# EAGLE design bridge (EAGLE 7.7.0)
REVISION: A
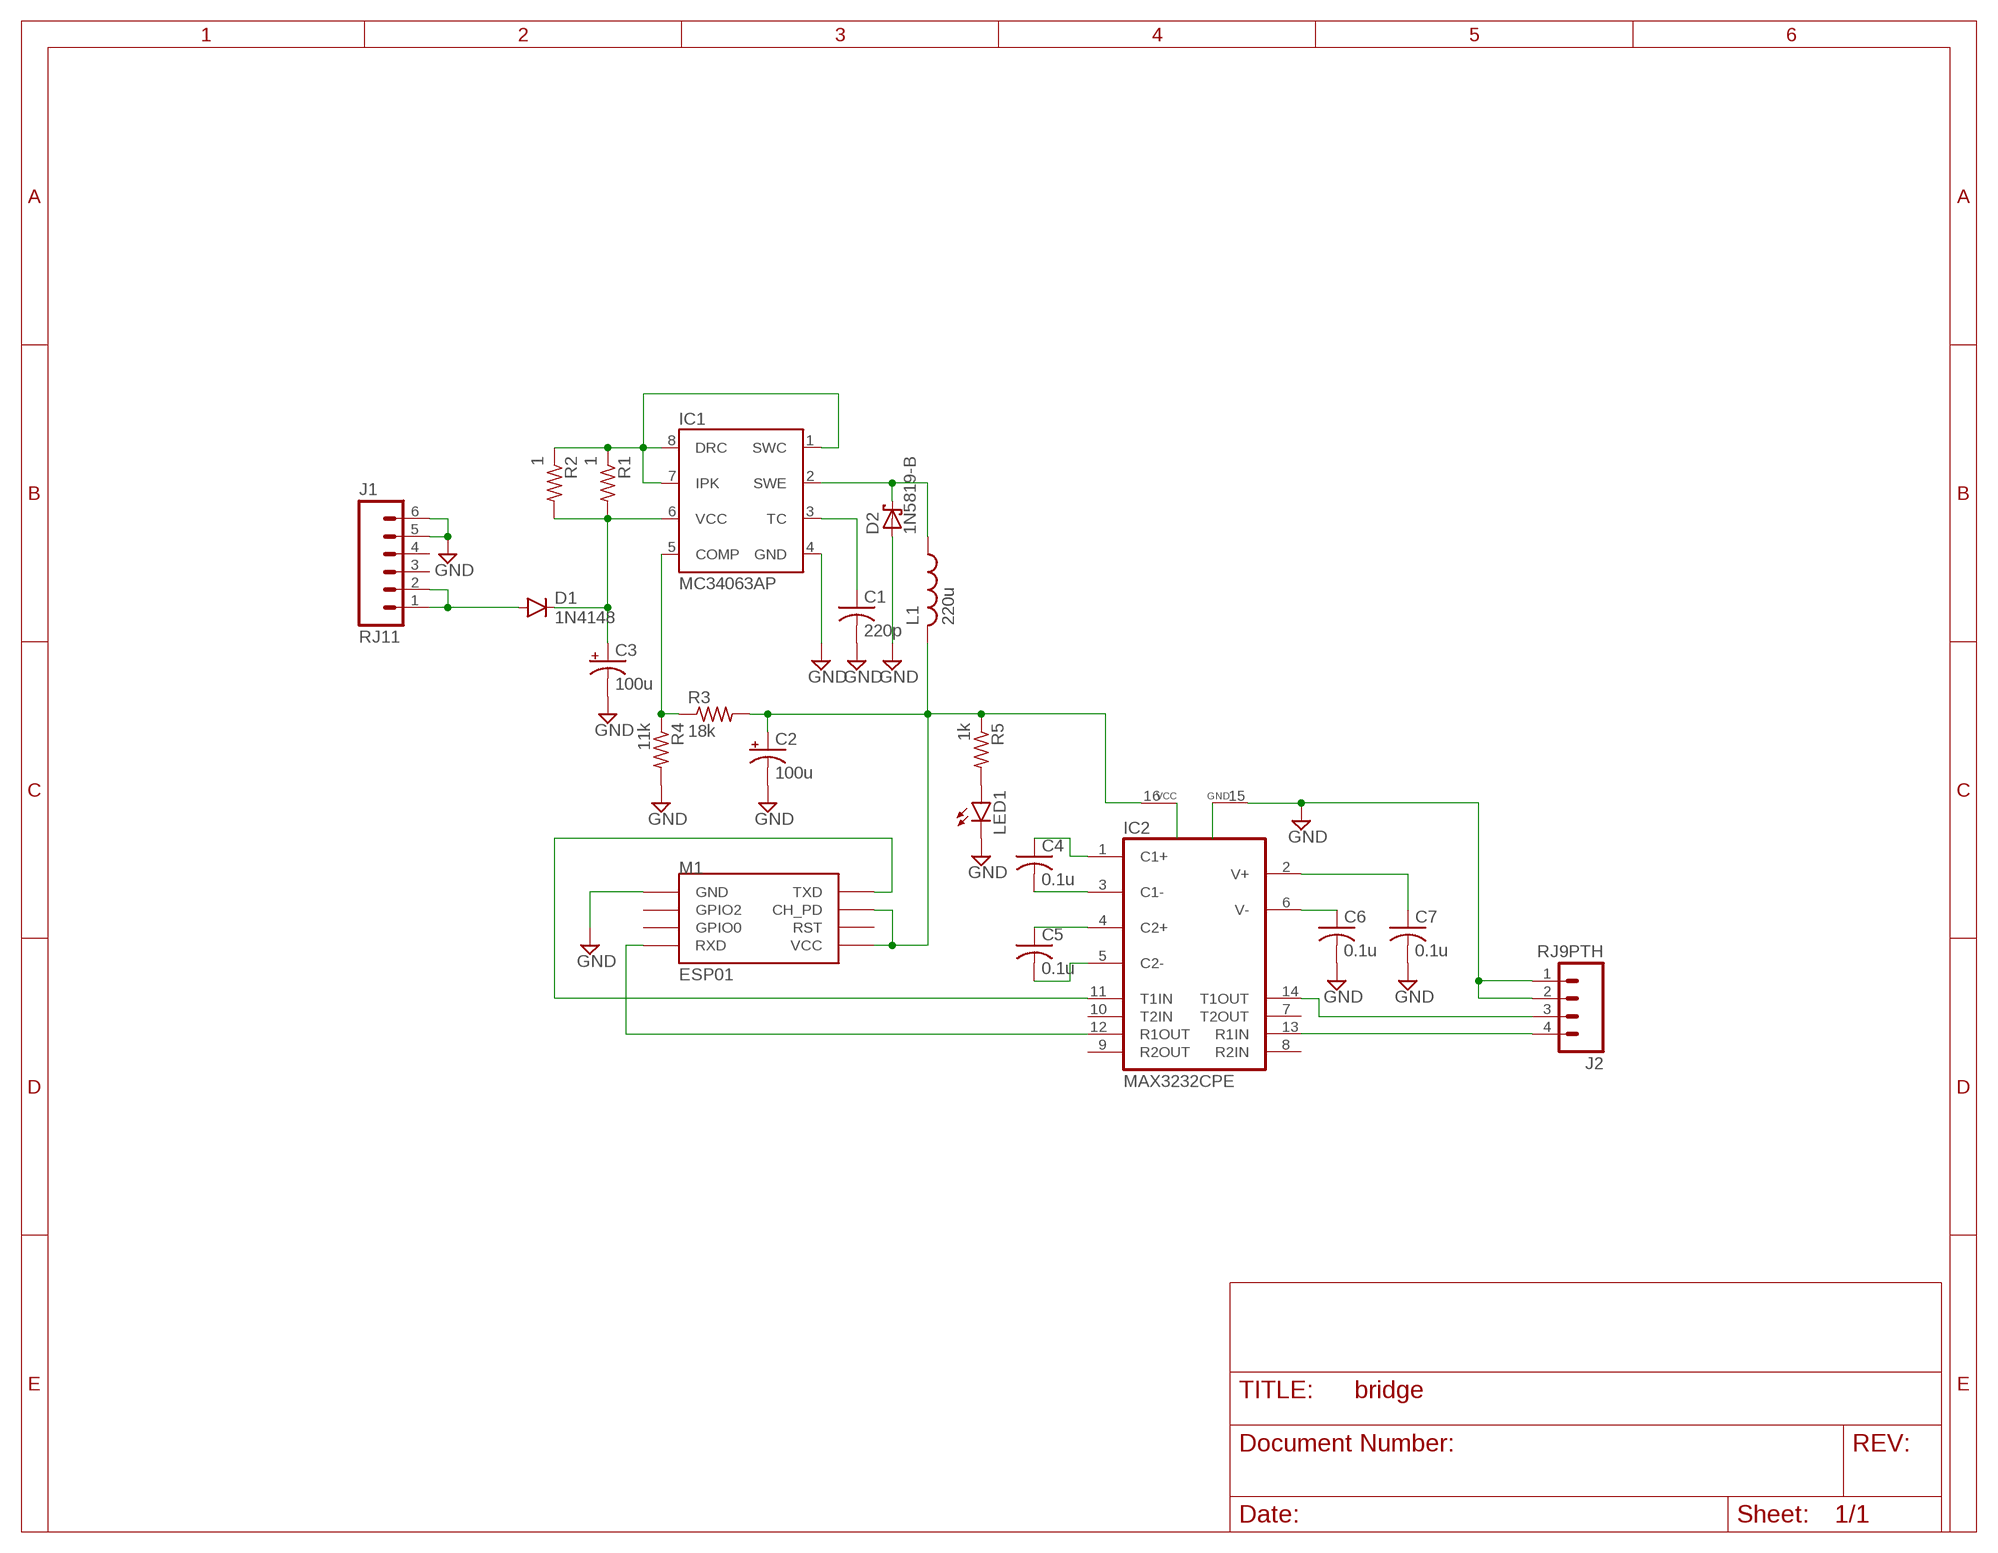
[diagram p0: schematic, sheet 1]
FRAME1 (FRAME_A_L): DESCRIPTION: Wi-Fi to RS-232 bridge; REVISION: A

## Parts
C1  220p  C-US025-024X044  [C025-024X044]
C2  100u  CPOL-USE2.5-6  [E2,5-6]
C3  100u  CPOL-USE2,5-6E  [E2,5-6E]
C4  0.1u  C-US025-024X044  [C025-024X044]
C5  0.1u  C-US025-024X044  [C025-024X044]
C6  0.1u  C-US025-024X044  [C025-024X044]
C7  0.1u  C-US025-024X044  [C025-024X044]
D1  1N4148  DIODE1N4148  [DIODE-1N4148]
D2  1N5819-B  [DO41-7.6]
IC1  MC34063AP  [DIL-08]
IC2  MAX3232CPE  [DIL16]
J1  RJ11  RJ11-6PTH  [RJ11-6]
J2  RJ9PTH  [RJ9]
L1  220u  L-US6000-XXX-RC  [6000-XXXX-RC]
LED1  LED5MM  [LED5MM]
M1  ESP01  [ESP01]
R1  1  R-US_0204/2V  [0204V]
R2  1  R-US_0204/2V  [0204V]
R3  18k  R-US_0204/2V  [0204V]
R4  11k  R-US_0204/2V  [0204V]
R5  1k  R-US_0204/7  [0204/7]

## Nets
3V3: C2.+ IC2.16(VCC) L1.2 M1.CH_PD M1.VCC R3.2 R5.1
12V: C3.+ D1.C IC1.6(VCC) R1.2 R2.2
GND: C1.2 C2.- C3.- C6.2 C7.2 D2.A IC1.4(GND) IC2.15(GND) J1.5 J1.6 J2.1 J2.2 LED1.K(C) M1.GND R4.2
N$3: C1.1 IC1.3(TC)
N$4: LED1.A R5.2
N$5: D2.C IC1.2(SWE) L1.1
N$6: IC2.11(T1IN) M1.TX(TXD)
N$7: IC2.12(R1OUT) M1.RX(RXD)
N$8: C4.2 IC2.3(C1-)
N$9: C4.1 IC2.1(C1+)
N$10: C5.1 IC2.4(C2+)
N$11: C5.2 IC2.5(C2-)
N$12: C6.1 IC2.6(V-)
N$13: C7.1 IC2.2(V+)
N$14: IC2.14(T1OUT) J2.3
N$15: IC2.13(R1IN) J2.4
N$16: IC1.1(SWC) IC1.7(IPK) IC1.8(DRC) R1.1 R2.1
N$18: IC1.5(COMP) R3.1 R4.1
VBATT: D1.A J1.1 J1.2
Unconnected: IC2.7(T2OUT) IC2.8(R2IN) IC2.9(R2OUT) IC2.10(T2IN) J1.3 J1.4 M1.GPIO0 M1.GPIO2 M1.RST

## Library data of the parts
C1 C4-C7 = rcl:C-US: CAPACITOR, American symbol
C2 C3 = rcl:CPOL-US: POLARIZED CAPACITOR, American symbol
D1 = SparkFun-DiscreteSemi:DIODE: Diode These are standard reverse protection diodes and small signal diodes. SMA package can handle up to about 1A. SOD-323 can handle about 200mA. What the SOD-323 package when ordering, there are some mfgs out there that are 5-pin packages.
D2 = diode:1N581*: 1.0A SCHOTTKY BARRIER RECTIFIER Source: http://www.diodes.com/datasheets/ds23001.pdf
IC1 = v-reg-3:MC34063A: 1.5A Step-Up/Down/Inverting Switching Regulator NPN Darlington Switch, Vin 3V to 40V, Current Limiter Input, adjustable Frequency up to 100kHz
IC2 = maxim:MAX3232*: True RS-232 Transceivers 3.0V to 5.5V, Low-Power up to 1Mbps, Using Four 0.1µF External Capacitors Source: http://pdfserv.maxim-ic.com/en/ds/MAX3222-MAX3241.pdf; MF: MAXIM; MPN: MAX3232CPE+; OC_FARNELL: 9724494; OC_NEWARK: 68K4626
J1 = SparkFun-Connectors:RJ11-6: RJ11 Jack Simple 6 pin RJ11 jack. Commonly found on CAT3 devices and Microchip programmers. SKU: PRT-00132; PROD_ID: CONN-08590
J2 = SparkFun-Connectors:RJ9: RJ9 connector (e.g., phone handsets)
L1 = rcl:L-US: INDUCTOR, American symbol
LED1 = SparkFun-LED:LED: LEDs Standard schematic elements and footprints for 5mm, 3mm, 1206, and 0603 sized LEDs. 5mm - Spark Fun Electronics SKU : COM-00529 (and others)
M1 = esp8266modules:ESP01: ESP8266 Wifi module 01
R1-R5 = rcl:R-US_: RESISTOR, American symbol

## Board
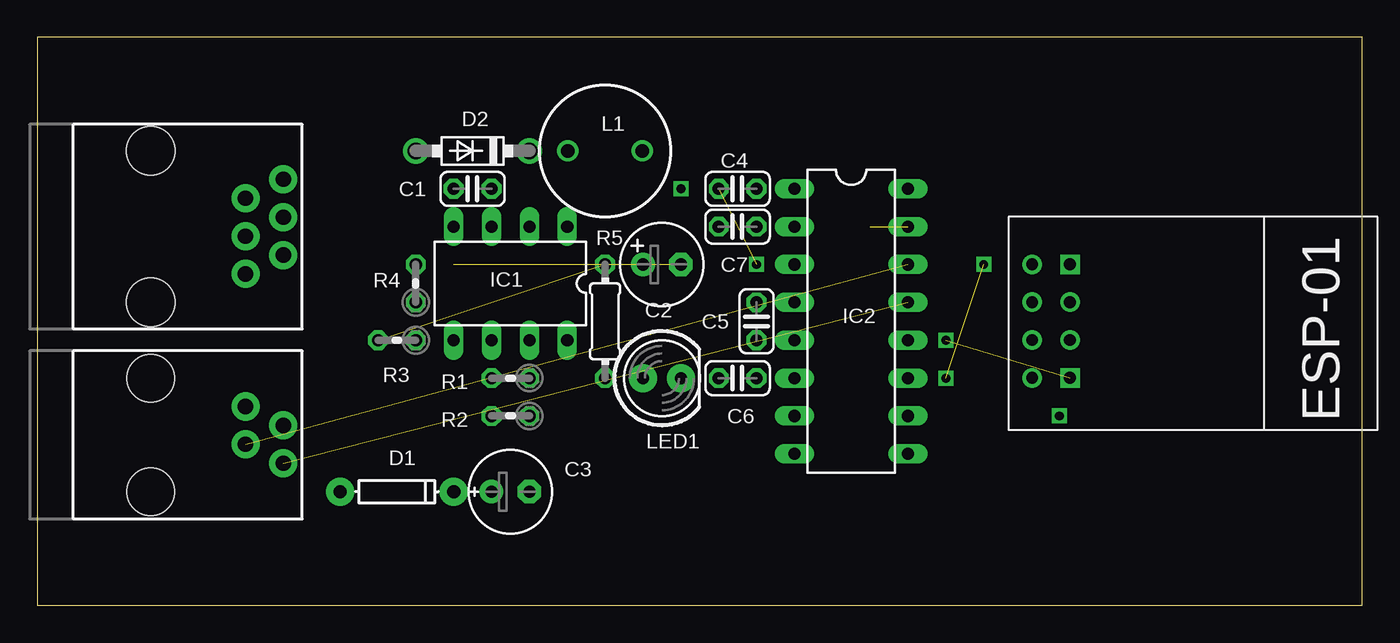
[diagram p1: board, top side]
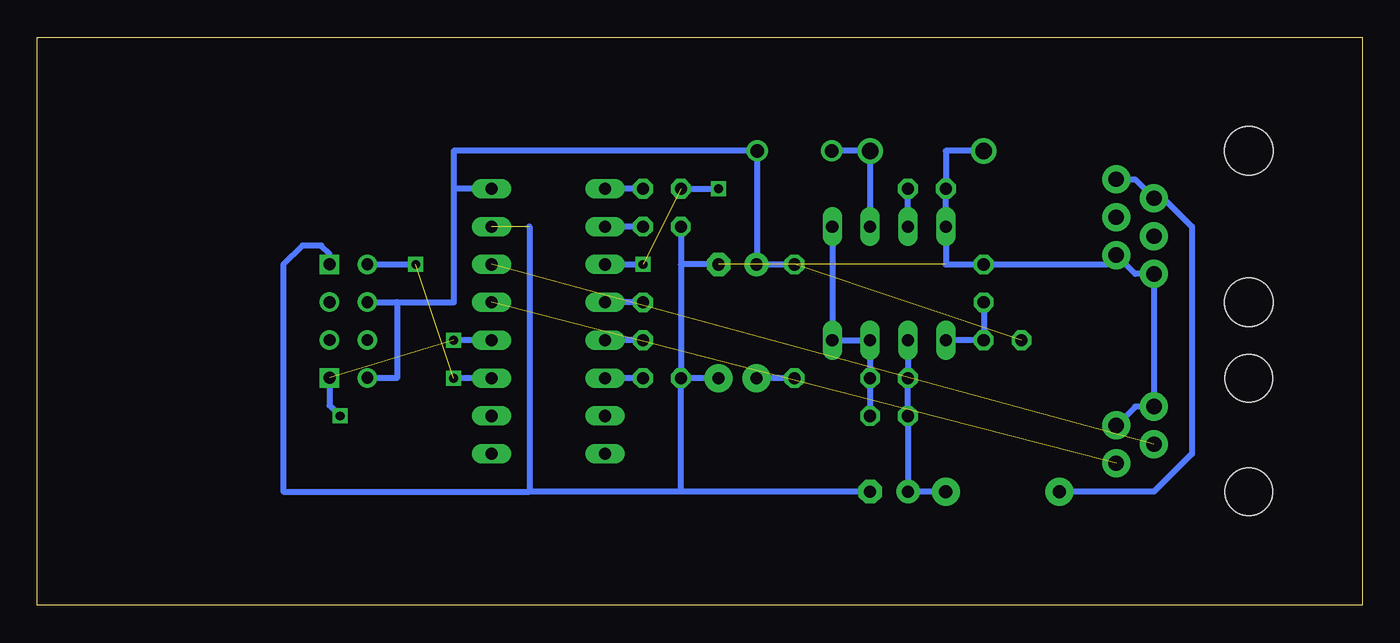
[diagram p2: board, bottom side, seen from below]

Size 88.9 x 38.1 mm. Coordinates in mm from the lower left corner, seen from the top.
Outline: 0,38.1 0,0 88.9,0 88.9,38.1 0,38.1
Copper layers (1*16): Top 0.035mm / dielectric 1.5mm / Bottom 0.035mm
Design rules "default": minimum track width 10mil, minimum drill 24mil, track to track 8mil, track to pad 8mil, pad to pad 8mil, via to via 8mil, smd to smd 8mil, copper to edge 40mil, drill to drill 8mil, minimum pad ring 10mil, minimum via ring 8mil, stop-mask expansion 4mil, vias tented up to drill 0mil, thermal gap 10mil

### Footprints (pad centres in the part's own frame; a part is rotated, then mirrored left to right if it is on the bottom)
C025-024X044 = drill 0.813 octagon: 1 -1.27,0; 2 1.27,0
E2,5-6 = drill 0.813 pad 1.6: + -1.27,0 | drill 0.813 pad 1.6 octagon: - 1.27,0
E2,5-6E = drill 0.813 pad 1.575: + -1.27,0 | drill 0.813 pad 1.575 octagon: - 1.27,0
DIODE-1N4148 = drill 0.9 pad 1.88: A -3.81,0; C 3.81,0
DO41-7.6 = drill 1.1 pad 1.7: A 3.81,0; C -3.81,0
DIL-08 = drill 0.813 long: 1 -3.81,-3.81; 2 -1.27,-3.81; 3 1.27,-3.81; 4 3.81,-3.81; 5 3.81,3.81; 6 1.27,3.81; 7 -1.27,3.81; 8 -3.81,3.81
DIL16 = drill 0.813 long: 1 -8.89,-3.81; 2 -6.35,-3.81; 3 -3.81,-3.81; 4 -1.27,-3.81; 5 1.27,-3.81; 6 3.81,-3.81; 7 6.35,-3.81; 8 8.89,-3.81; 9 8.89,3.81; 10 6.35,3.81; 11 3.81,3.81; 12 1.27,3.81; 13 -1.27,3.81; 14 -3.81,3.81; 15 -6.35,3.81; 16 -8.89,3.81
RJ11-6 = drill 1.016 pad 1.88: 1 -3.175,8.89; 2 -1.905,6.35; 3 -0.635,8.89; 4 0.635,6.35; 5 1.905,8.89; 6 3.175,6.35 | hole 3.251: -5.08,0; 5.08,0
RJ9 = drill 1.016 pad 1.88: 1 -1.905,6.35; 2 -0.635,8.89; 3 0.635,6.35; 4 1.905,8.89 | hole 3.2: -3.81,0; 3.81,0
6000-XXXX-RC = drill 0.9 pad 1.422: 1 -2.5,0; 2 2.5,0
LED5MM = drill 0.813 pad 1.88: A -1.27,0; K 1.27,0
ESP01 = drill 0.8: CH_PD -1.285,-8.178; GPIO0 1.255,-5.638; GPIO2 -1.285,-5.638; RST 1.255,-8.178; TX -3.825,-8.178; VCC 3.795,-8.178 | drill 0.8 square: GND -3.825,-5.638; RX 3.795,-5.638
0204V = drill 0.813 octagon: 1 -1.27,0; 2 1.27,0
0204/7 = drill 0.813 octagon: 1 -3.81,0; 2 3.81,0

### Placement (x,y rotation side)
C1  29.21,27.94 180 top
C2  41.91,22.86 0 top
C3  31.75,7.62 0 top
C4  46.99,27.94 180 top
C5  48.26,19.05 270 top
C6  46.99,15.24 180 top
C7  46.99,25.4 180 top
D1  24.13,7.62 0 top
D2  29.21,30.48 180 top
IC1  31.75,21.59 180 top
IC2  54.61,19.05 270 top
J1  7.62,25.4 270 top
J2  7.62,11.43 270 top
L1  38.1,30.48 0 top
LED1  41.91,15.24 0 top
M1  74.93,19.05 270 top
R1  31.75,15.24 180 top
R2  31.75,12.7 180 top
R3  24.13,17.78 180 top
R4  25.4,21.59 90 top
R5  38.1,19.05 270 top

### Tracks (layer width: path | path; a pad name or v marks a point on that pad's centre or on a via)
3V3  (1 unrouted)
  Bottom 0.406: R5.1 C2.+ 40.6,24.13 L1.2 60.96,30.48 60.96,27.94 | IC2.16 60.96,27.94 | M1.VCC 64.78,15.26 64.77,15.24 64.77,20.32 | M1.CH_PD 64.78,20.34 64.77,20.32 | 64.77,20.32 60.96,20.32 60.96,27.94
12V
  Bottom 0.406: IC1.6 R1.2 R2.2 C3.+ D1.C
GND  (2 unrouted)
  Bottom 0.406: D2.A 27.94,30.48 C1.2 IC1.4 27.94,22.86 R4.2 17.14,22.86 J1.5 15.24,22.23 J1.6 J2.1 15.24,13.34 J2.2 | C3.- 45.72,7.62 | 45.72,7.62 C6.2 | C2.- 45.72,22.86 | LED1.K C6.2 | C7.2 45.72,22.86 | 45.72,22.86 C6.2 | 45.72,7.62 55.88,7.62 | 55.88,25.4 55.88,7.62 | M1.GND 69.29,23.57 69.85,24.13 71.12,24.13 72.39,22.86 72.39,7.62 55.88,7.62
N$1  (via drill 0.6)
  other vias: 43.18,27.94
N$3
  Bottom 0.406: IC1.3 C1.1
N$4
  Bottom 0.406: R5.2 LED1.A
N$5
  Bottom 0.406: L1.1 D2.C IC1.2
N$6  (via drill 0.6)  (1 unrouted)
  Bottom 0.406: M1.TX 64.78,22.88 v63.5,22.86 | IC2.11 v60.96,15.24
N$7  (via drill 0.6)  (1 unrouted)
  Bottom 0.406: IC2.12 v60.96,17.78 | M1.RX 69.29,13.41 v68.58,12.7
N$8  (via drill 0.6)  (1 unrouted)
  Bottom 0.406: IC2.3 v48.26,22.86 | C4.2 43.18,27.94
N$9
  Bottom 0.406: C4.1 IC2.1
N$10
  Bottom 0.406: C5.1 IC2.4
N$11
  Bottom 0.406: C5.2 IC2.5
N$12
  Bottom 0.406: C6.1 IC2.6
N$13
  Bottom 0.406: C7.1 IC2.2
N$14  (1 unrouted)
N$15  (1 unrouted)
N$16
  Bottom 0.406: IC1.1 IC1.8 IC1.7 R1.1 R2.1
N$18
  Bottom 0.406: R4.1 R3.1 IC1.5
VBATT
  Bottom 0.406: J1.1 15.24,28.57 J1.2 13.34,27.3 11.43,25.4 11.43,10.16 13.97,7.62 D1.A